# EAGLE schematic Full_power (EAGLE 7.7.0)
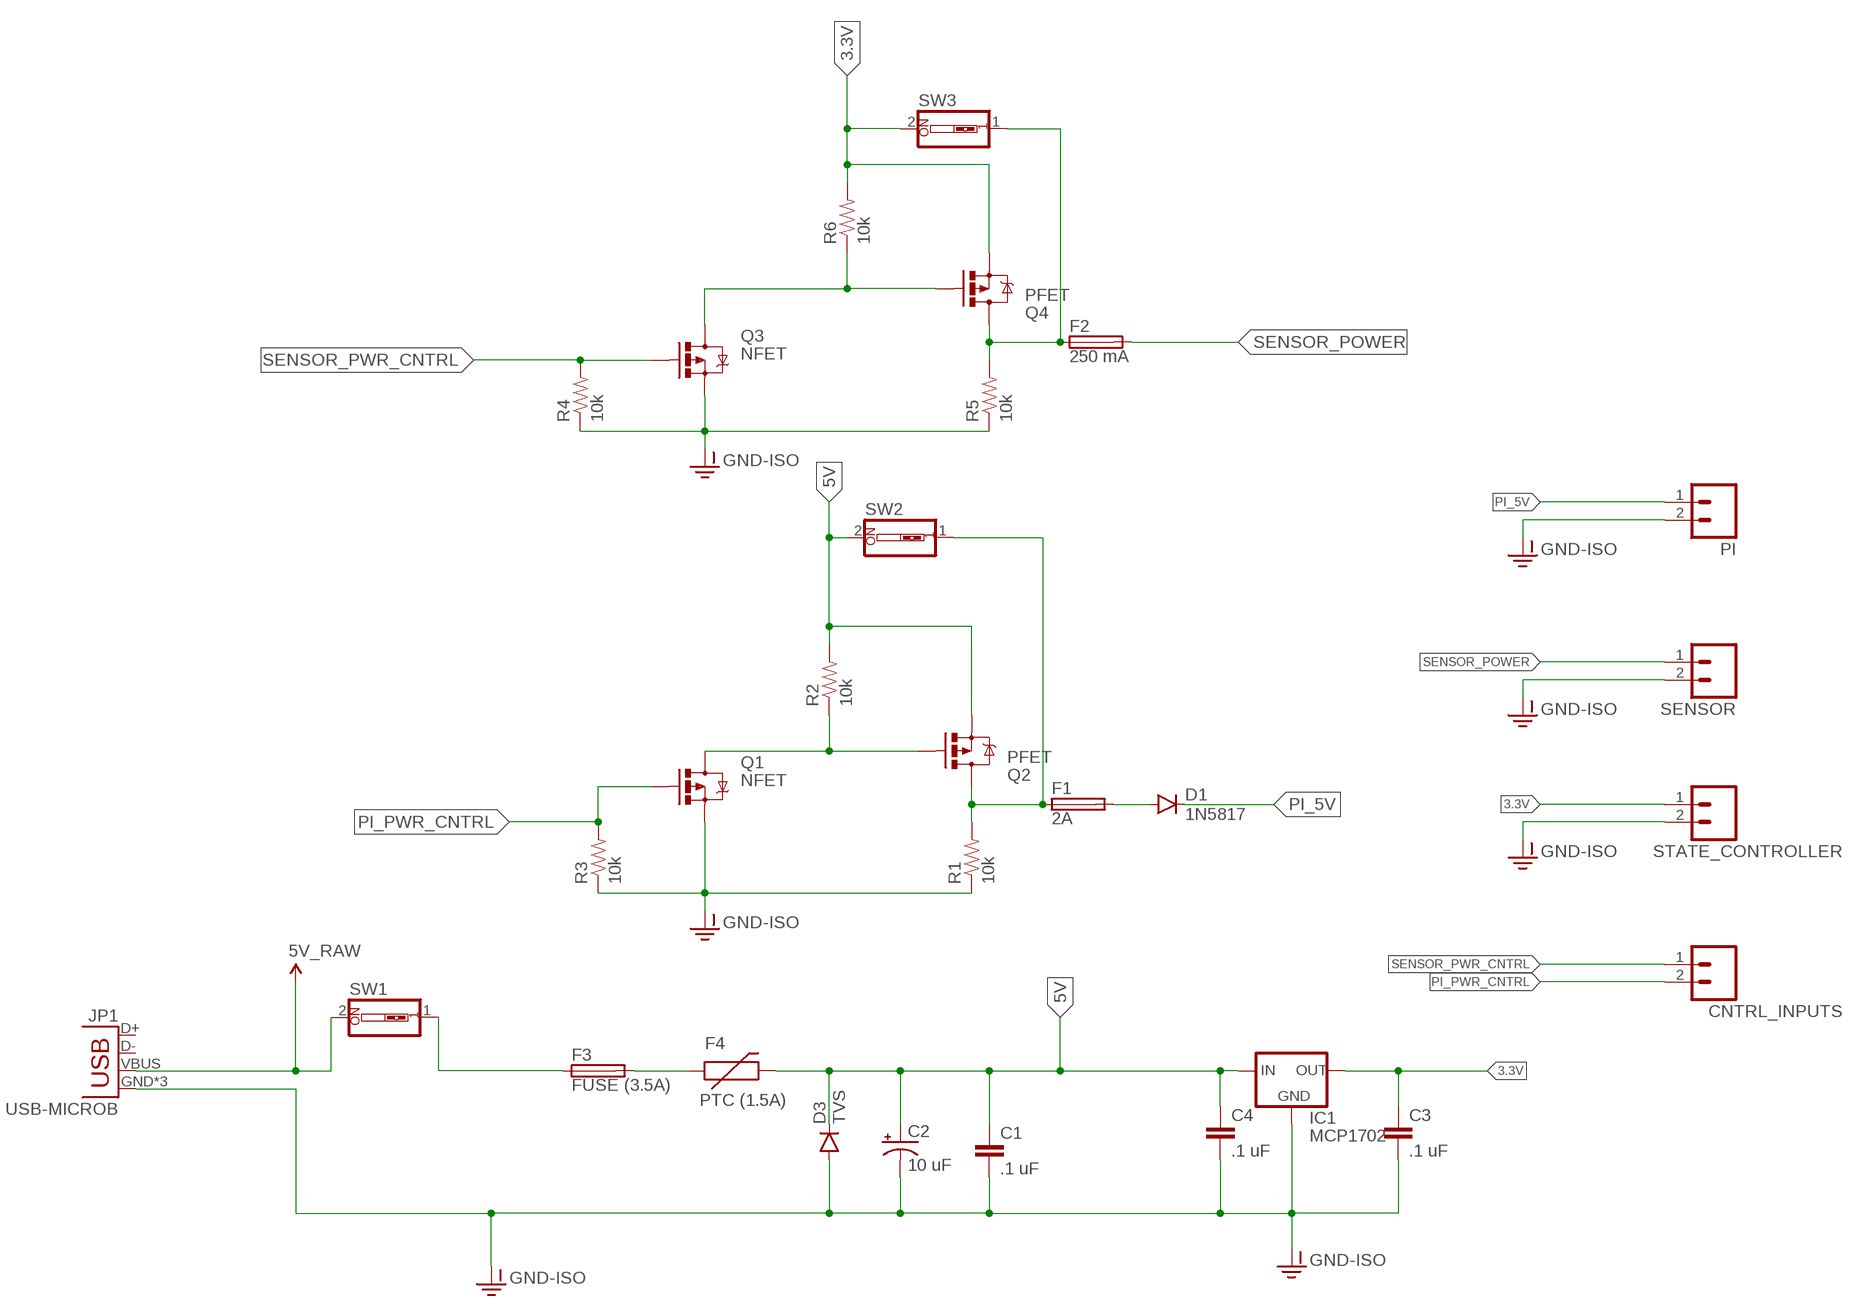
[diagram p0: schematic, sheet 1]

## Parts
C1  .1 uF  CAPPTH  [CAP-PTH-SMALL]
C2  10 uF  CAP_POLPTH2  [CPOL-RADIAL-10UF-25V]
C3  .1 uF  CAPPTH  [CAP-PTH-SMALL]
C4  .1 uF  CAPPTH  [CAP-PTH-SMALL]
CNTRL_INPUTS  M02PTH  [1X02]
D1  1N5817  DIODEPTH  [DIODE-1N4001]
D3  TVS  DIODEPTH  [DIODE-1N4001]
F1  2A  FUSEPICOFUSE  [PICOFUSE]
F2  250 mA  FUSEPICOFUSE  [PICOFUSE]
F3  FUSE (3.5A)  PICOFUSE  [PICOFUSE]
F4  PTC (1.5A)  PTCPTH  [PTC]
IC1  MCP1702  MCP1700TRI  [TO92]
JP1  USB-MICROB  [USB-MICROB]
PI  M02PTH  [1X02]
Q1  NFET  MOSFET-PCHANNELFQP27P06  [TO220V]
Q2  PFET  MOSFET-PCHANNELFQP27P06  [TO220V]
Q3  NFET  MOSFET-PCHANNELFQP27P06  [TO220V]
Q4  PFET  MOSFET-PCHANNELFQP27P06  [TO220V]
R1  10k  RESISTOR1206  [1206]
R2  10k  RESISTOR1206  [1206]
R3  10k  RESISTOR1206  [1206]
R4  10k  RESISTOR1206  [1206]
R5  10k  RESISTOR1206  [1206]
R6  10k  RESISTOR1206  [1206]
SENSOR  M02PTH  [1X02]
STATE_CONTROLLER  M02PTH  [1X02]
SW1  SW_DIP-1  [EDG-01]
SW2  SW_DIP-1  [EDG-01]
SW3  SW_DIP-1  [EDG-01]

## Nets
3.3V: C3.1 IC1.3(OUT) Q4.3(S) R6.2 STATE_CONTROLLER.1 SW3.2
5V: C1.1 C2.1(+) C4.1 D3.C F4.P$2 IC1.2(IN) Q2.3(S) R2.2 SW2.2
5V_RAW: JP1.VBUS SW1.2
5V_SWITCH: F3.1 SW1.1
GND-ISO: C1.2 C2.2(-) C3.2 C4.2 D3.A IC1.1(GND) JP1.GND JP1.MT1(GND) JP1.MT2(GND) PI.2 Q1.3(S) Q3.3(S) R1.1 R3.1 R4.1 R5.1 SENSOR.2 STATE_CONTROLLER.2
N$1: Q3.2(D) Q4.1(G) R6.1
N$2: Q1.2(D) Q2.1(G) R2.1
N$4: F1.1 Q2.2(D) R1.2 SW2.1
N$5: D1.A F1.2
N$6: F2.1 Q4.2(D) R5.2 SW3.1
N$7: F3.2 F4.P$1
PI_5V: D1.C PI.1
PI_PWR_CNTRL: CNTRL_INPUTS.2 Q1.1(G) R3.2
SENSOR_POWER: F2.2 SENSOR.1
SENSOR_PWR_CNTRL: CNTRL_INPUTS.1 Q3.1(G) R4.2
Unconnected: JP1.D+ JP1.D-

## Library data of the parts
C1 = SparkFun-Passives:CAP: Capacitor Standard 0603 ceramic capacitor, and 0.1" leaded capacitor.
C2 = SparkFun-Passives:CAP_POL: Capacitor Polarized These are standard SMD and PTH capacitors. Normally 10uF, 47uF, and 100uF in electrolytic and tantalum varieties. Always verify the external diameter of the through hole cap, it varies with capacity, voltage, and manufacturer. The EIA devices should be standard.
C3 C4 = SparkFun-Capacitors:CAP: Capacitor Standard 0603 ceramic capacitor, and 0.1" leaded capacitor.
CNTRL_INPUTS PI SENSOR STATE_CONTROLLER = SparkFun-Connectors:M02: Standard 2-pin 0.1" header. Use with - straight break away headers ( PRT-00116) - right angle break away headers (PRT-00553) - swiss pins (PRT-00743) - machine pins (PRT-00117) - female headers (PRT-00115) Molex polarized connector foot print use with: PRT-08233 with associated crimp pins and housings. 2.54_SCREWTERM for use with PRT-10571. 3.5mm Screw Terminal footprints for PRT-08084 5mm Screw Terminal footprints for use with PRT-08432
D1 D3 = SparkFun-DiscreteSemi:DIODE: Diode These are standard reverse protection diodes and small signal diodes. SMA package can handle up to about 1A. SOD-323 can handle about 200mA. What the SOD-323 package when ordering, there are some mfgs out there that are 5-pin packages.
F1 F2 = fuse:FUSE: Fuse; OC_FARNELL: unknown; OC_NEWARK: unknown
F3 = fuse:PICOFUSE: PICOFUSE 19275, Wickmann; OC_FARNELL: unknown; OC_NEWARK: unknown
F4 = SparkFun-PowerIC:PTC: Resettable Fuse PTC Resettable Fuse. Spark Fun Electronics SKU : COM-08357
IC1 = adafruit:MCP1700: VOLTAGE REGULATOR
JP1 = SparkFun-Connectors:USB: USB Connectors USB-B-PTH is fully proven SKU : PRT-00139/CONN-08278 USB-miniB is fully proven SKU : PRT-00587 USB-A-PCB is untested. USB-A-H is throughly reviewed, but untested. Spark Fun Electronics SKU : PRT-00437 USB-B-SMT is throughly reviewed, but untested. Needs silkscreen touching up. USB-A-S has not been used/tested USB-MB-H has not been used/tested USB-MICROB has been used. CONN-09505; PROD_ID: CONN-09505
Q1-Q4 = User-Submitted:MOSFET-PCHANNEL: Generic PMOSFET IRLML2244 - TRANS-11153 (SOT-23 -20V -4.3A) (1.Gate 2.Source 3.Drain) FQP27P06 - COM-10349 <http://www.sparkfun.com/products/10349> (TO-220 -60V -27A) (1.Gate 2.Source 3.Drain)
R1-R6 = SparkFun-Resistors:RESISTOR: Resistor Basic schematic elements and footprints for 0603, 1206, and PTH resistors.
SW1-SW3 = special:SW_DIP-1: DIP SWITCH

## Net classes
0 default: width 0.508 mm